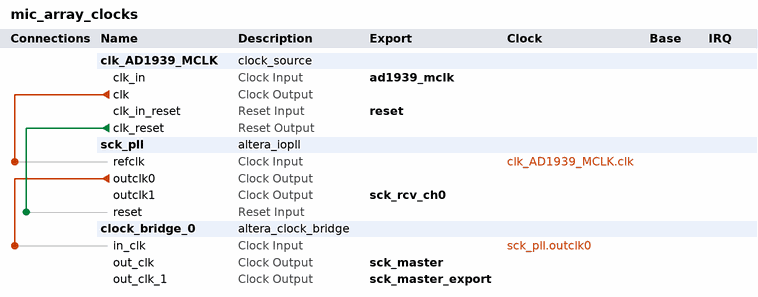
[diagram p0: system contents]
# Platform Designer (Qsys) system mic_array_clocks, Arria 10 10AS066H2F34I1SG
# Parameters at their usual value, and those the tool derives, are not listed.
package require -exact qsys 18.0
create_system mic_array_clocks
set_project_property DEVICE_FAMILY {Arria 10}
set_project_property DEVICE 10AS066H2F34I1SG

add_instance clk_AD1939_MCLK clock_source 18.0
set_instance_parameter_value clk_AD1939_MCLK clockFrequency 12288000

add_instance sck_pll altera_iopll 18.0
set_instance_parameter_value sck_pll gui_c_cnt_in_src0 c_m_cnt_in_src_ph_mux_clk
set_instance_parameter_value sck_pll gui_c_cnt_in_src1 c_m_cnt_in_src_ph_mux_clk
set_instance_parameter_value sck_pll gui_cal_code_hex_file iossm.hex
set_instance_parameter_value sck_pll gui_cal_converge false
set_instance_parameter_value sck_pll gui_cal_error cal_clean
set_instance_parameter_value sck_pll gui_clock_name_global false
set_instance_parameter_value sck_pll gui_clock_name_string0 sck_master
set_instance_parameter_value sck_pll gui_clock_name_string1 sck_rcv_ch0
set_instance_parameter_value sck_pll gui_clock_to_compensate 0
set_instance_parameter_value sck_pll gui_debug_mode false
set_instance_parameter_value sck_pll gui_en_lvds_ports Disabled
set_instance_parameter_value sck_pll gui_existing_mif_file_path {~/pll.mif}
set_instance_parameter_value sck_pll gui_include_iossm false
set_instance_parameter_value sck_pll gui_lock_setting {Low Lock Time}
set_instance_parameter_value sck_pll gui_mif_config_name unnamed
set_instance_parameter_value sck_pll gui_mif_gen_options {Generate New MIF File}
set_instance_parameter_value sck_pll gui_new_mif_file_path {~/pll.mif}
set_instance_parameter_value sck_pll gui_number_of_clocks 2
set_instance_parameter_value sck_pll gui_operation_mode direct
set_instance_parameter_value sck_pll gui_output_clock_frequency0 24.576
set_instance_parameter_value sck_pll gui_output_clock_frequency1 24.576
set_instance_parameter_value sck_pll gui_parameter_table_hex_file seq_params_sim.hex
set_instance_parameter_value sck_pll gui_phase_shift1 26000.0
set_instance_parameter_value sck_pll gui_pll_cal_done false
set_instance_parameter_value sck_pll gui_pll_freqcal_en true
set_instance_parameter_value sck_pll gui_pll_freqcal_req_flag true
set_instance_parameter_value sck_pll gui_pll_m_cnt_in_src c_m_cnt_in_src_ph_mux_clk
set_instance_parameter_value sck_pll gui_pll_tclk_mux_en false
set_instance_parameter_value sck_pll gui_pll_tclk_sel pll_tclk_m_src
set_instance_parameter_value sck_pll gui_pll_type S10_Simple
set_instance_parameter_value sck_pll gui_pll_vco_freq_band_0 pll_freq_clk0_disabled
set_instance_parameter_value sck_pll gui_pll_vco_freq_band_1 pll_freq_clk1_disabled
set_instance_parameter_value sck_pll gui_reference_clock_frequency 12.288
set_instance_parameter_value sck_pll gui_use_NDFB_modes false
set_instance_parameter_value sck_pll gui_use_locked false
set_instance_parameter_value sck_pll gui_usr_device_speed_grade 1
set_instance_parameter_value sck_pll gui_vco_frequency 600.0
set_instance_parameter_value sck_pll hp_qsys_scripting_mode false
set_instance_parameter_value sck_pll system_info_device_component 10AS066H2F34I1SG
set_instance_parameter_value sck_pll system_info_device_speed_grade 1
set_instance_parameter_value sck_pll system_part_trait_speed_grade 1

add_instance clock_bridge_0 altera_clock_bridge 18.0
set_instance_parameter_value clock_bridge_0 DERIVED_CLOCK_RATE 24576000
set_instance_parameter_value clock_bridge_0 EXPLICIT_CLOCK_RATE 0
set_instance_parameter_value clock_bridge_0 NUM_CLOCK_OUTPUTS 2

# connections
add_connection clk_AD1939_MCLK.clk sck_pll.refclk clock
add_connection sck_pll.outclk0 clock_bridge_0.in_clk clock
add_connection clk_AD1939_MCLK.clk_reset sck_pll.reset reset

# exported interfaces
add_interface ad1939_mclk clock sink
set_interface_property ad1939_mclk EXPORT_OF clk_AD1939_MCLK.clk_in
add_interface reset reset sink
set_interface_property reset EXPORT_OF clk_AD1939_MCLK.clk_in_reset
add_interface sck_master clock source
set_interface_property sck_master EXPORT_OF clock_bridge_0.out_clk
add_interface sck_master_export clock source
set_interface_property sck_master_export EXPORT_OF clock_bridge_0.out_clk_1
add_interface sck_rcv_ch0 clock source
set_interface_property sck_rcv_ch0 EXPORT_OF sck_pll.outclk1

set_interconnect_requirement {$system} qsys_mm.clockCrossingAdapter HANDSHAKE
set_interconnect_requirement {$system} qsys_mm.enableEccProtection FALSE
set_interconnect_requirement {$system} qsys_mm.insertDefaultSlave FALSE
set_interconnect_requirement {$system} qsys_mm.maxAdditionalLatency 1

save_system mic_array_clocks.qsys
